# Altium schematic sheet tie-il1.SchDoc: Net Tie IL1
size Letter; CheckedBy: J. Brinton; CompanyName: Signal Laboratories, Inc.; DrawnBy: J. Brinton; Engineer: J. Brinton; Address1: 3479 Edison Way; Address2: Menlo Park CA 94025; Address3: +1 (877) 778-8435; Address4: siglabs.com; Revision: 3; SheetNumber: 43; SheetTotal: 45
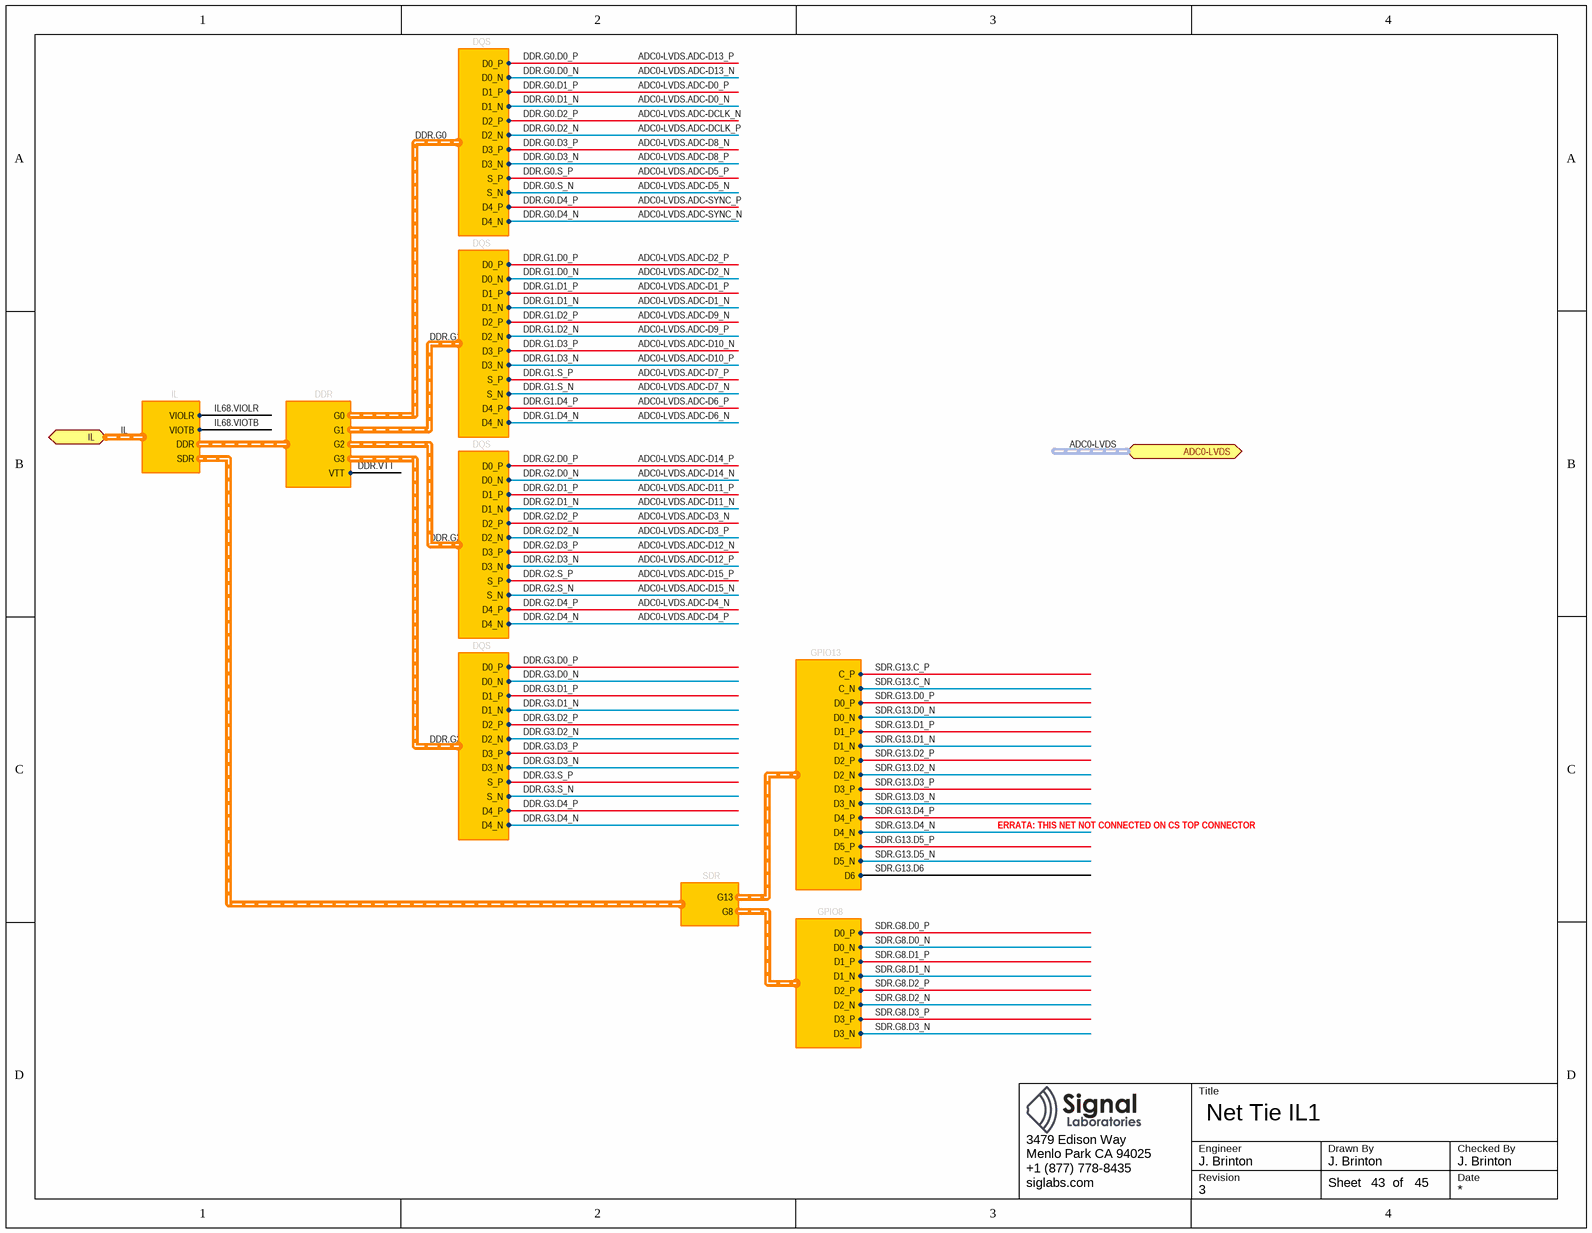
[diagram p0: tie-il1.SchDoc]

## Ports
ADC0-LVDS (harness ADC-LVDS), IL (harness IL)

## Harnesses
DQS: D0_P, D0_N, D1_P, D1_N, D2_P, D2_N, D3_P, D3_N, D4_P, D4_N, S_P, S_N
DDR: G0, G1, G2, G3, VTT
GPIO8: D0_P, D0_N, D1_P, D1_N, D2_P, D2_N, D3_P, D3_N
SDR: G13, G8
GPIO13: C_P, C_N, D0_P, D0_N, D1_P, D1_N, D2_P, D2_N, D3_P, D3_N, D4_P, D4_N, D5_P, D5_N, D6
IL: DDR, SDR, VIOLR, VIOTB

## Nets
ADC0-LVDS.ADC-D0_N: harness DQS.D1_N  [also labelled DDR.G0.D1_N]
ADC0-LVDS.ADC-D0_P: harness DQS.D1_P  [also labelled DDR.G0.D1_P]
ADC0-LVDS.ADC-D1_N: harness DQS.D1_N  [also labelled DDR.G1.D1_N]
ADC0-LVDS.ADC-D1_P: harness DQS.D1_P  [also labelled DDR.G1.D1_P]
ADC0-LVDS.ADC-D2_N: harness DQS.D0_N  [also labelled DDR.G1.D0_N]
ADC0-LVDS.ADC-D2_P: harness DQS.D0_P  [also labelled DDR.G1.D0_P]
ADC0-LVDS.ADC-D3_N: harness DQS.D2_P  [also labelled DDR.G2.D2_P]
ADC0-LVDS.ADC-D3_P: harness DQS.D2_N  [also labelled DDR.G2.D2_N]
ADC0-LVDS.ADC-D4_N: harness DQS.D4_P  [also labelled DDR.G2.D4_P]
ADC0-LVDS.ADC-D4_P: harness DQS.D4_N  [also labelled DDR.G2.D4_N]
ADC0-LVDS.ADC-D5_N: harness DQS.S_N  [also labelled DDR.G0.S_N]
ADC0-LVDS.ADC-D5_P: harness DQS.S_P  [also labelled DDR.G0.S_P]
ADC0-LVDS.ADC-D6_N: harness DQS.D4_N  [also labelled DDR.G1.D4_N]
ADC0-LVDS.ADC-D6_P: harness DQS.D4_P  [also labelled DDR.G1.D4_P]
ADC0-LVDS.ADC-D7_N: harness DQS.S_N  [also labelled DDR.G1.S_N]
ADC0-LVDS.ADC-D7_P: harness DQS.S_P  [also labelled DDR.G1.S_P]
ADC0-LVDS.ADC-D8_N: harness DQS.D3_P  [also labelled DDR.G0.D3_P]
ADC0-LVDS.ADC-D8_P: harness DQS.D3_N  [also labelled DDR.G0.D3_N]
ADC0-LVDS.ADC-D9_N: harness DQS.D2_P  [also labelled DDR.G1.D2_P]
ADC0-LVDS.ADC-D9_P: harness DQS.D2_N  [also labelled DDR.G1.D2_N]
ADC0-LVDS.ADC-D10_N: harness DQS.D3_P  [also labelled DDR.G1.D3_P]
ADC0-LVDS.ADC-D10_P: harness DQS.D3_N  [also labelled DDR.G1.D3_N]
ADC0-LVDS.ADC-D11_N: harness DQS.D1_N  [also labelled DDR.G2.D1_N]
ADC0-LVDS.ADC-D11_P: harness DQS.D1_P  [also labelled DDR.G2.D1_P]
ADC0-LVDS.ADC-D12_N: harness DQS.D3_P  [also labelled DDR.G2.D3_P]
ADC0-LVDS.ADC-D12_P: harness DQS.D3_N  [also labelled DDR.G2.D3_N]
ADC0-LVDS.ADC-D13_N: harness DQS.D0_N  [also labelled DDR.G0.D0_N]
ADC0-LVDS.ADC-D13_P: harness DQS.D0_P  [also labelled DDR.G0.D0_P]
ADC0-LVDS.ADC-D14_N: harness DQS.D0_N  [also labelled DDR.G2.D0_N]
ADC0-LVDS.ADC-D14_P: harness DQS.D0_P  [also labelled DDR.G2.D0_P]
ADC0-LVDS.ADC-D15_N: harness DQS.S_N  [also labelled DDR.G2.S_N]
ADC0-LVDS.ADC-D15_P: harness DQS.S_P  [also labelled DDR.G2.S_P]
ADC0-LVDS.ADC-DCLK_N: harness DQS.D2_P  [also labelled DDR.G0.D2_P]
ADC0-LVDS.ADC-DCLK_P: harness DQS.D2_N  [also labelled DDR.G0.D2_N]
ADC0-LVDS.ADC-SYNC_N: harness DQS.D4_N  [also labelled DDR.G0.D4_N]
ADC0-LVDS.ADC-SYNC_P: harness DQS.D4_P  [also labelled DDR.G0.D4_P]
DDR.G3.D0_N: harness DQS.D0_N
DDR.G3.D0_P: harness DQS.D0_P
DDR.G3.D1_N: harness DQS.D1_N
DDR.G3.D1_P: harness DQS.D1_P
DDR.G3.D2_N: harness DQS.D2_N
DDR.G3.D2_P: harness DQS.D2_P
DDR.G3.D3_N: harness DQS.D3_N
DDR.G3.D3_P: harness DQS.D3_P
DDR.G3.D4_N: harness DQS.D4_N
DDR.G3.D4_P: harness DQS.D4_P
DDR.G3.S_N: harness DQS.S_N
DDR.G3.S_P: harness DQS.S_P
DDR.VTT: harness DDR.VTT
IL68.VIOLR: port IL.VIOLR  [project net IL.VIOLR]
IL68.VIOTB: port IL.VIOTB  [project net IL.VIOTB]
SDR.G8.D0_N: harness GPIO8.D0_N
SDR.G8.D0_P: harness GPIO8.D0_P
SDR.G8.D1_N: harness GPIO8.D1_N
SDR.G8.D1_P: harness GPIO8.D1_P
SDR.G8.D2_N: harness GPIO8.D2_N
SDR.G8.D2_P: harness GPIO8.D2_P
SDR.G8.D3_N: harness GPIO8.D3_N
SDR.G8.D3_P: harness GPIO8.D3_P
SDR.G13.C_N: harness GPIO13.C_N
SDR.G13.C_P: harness GPIO13.C_P
SDR.G13.D0_N: harness GPIO13.D0_N
SDR.G13.D0_P: harness GPIO13.D0_P
SDR.G13.D1_N: harness GPIO13.D1_N
SDR.G13.D1_P: harness GPIO13.D1_P
SDR.G13.D2_N: harness GPIO13.D2_N
SDR.G13.D2_P: harness GPIO13.D2_P
SDR.G13.D3_N: harness GPIO13.D3_N
SDR.G13.D3_P: harness GPIO13.D3_P
SDR.G13.D4_N: harness GPIO13.D4_N
SDR.G13.D4_P: harness GPIO13.D4_P
SDR.G13.D5_N: harness GPIO13.D5_N
SDR.G13.D5_P: harness GPIO13.D5_P
SDR.G13.D6: harness GPIO13.D6

## Buses and harness runs
harness ADC0-LVDS = port ADC0-LVDS
harness IL = port IL

## Notes on the sheet
- ERRATA: THIS NET NOT CONNECTED ON CS TOP CONNECTOR
- Title
- Engineer
- Revision
- Drawn By
- Checked By
- Date
- Sheet
- of